# EAGLE schematic wled-switch-rev1 (EAGLE 7.3.0)
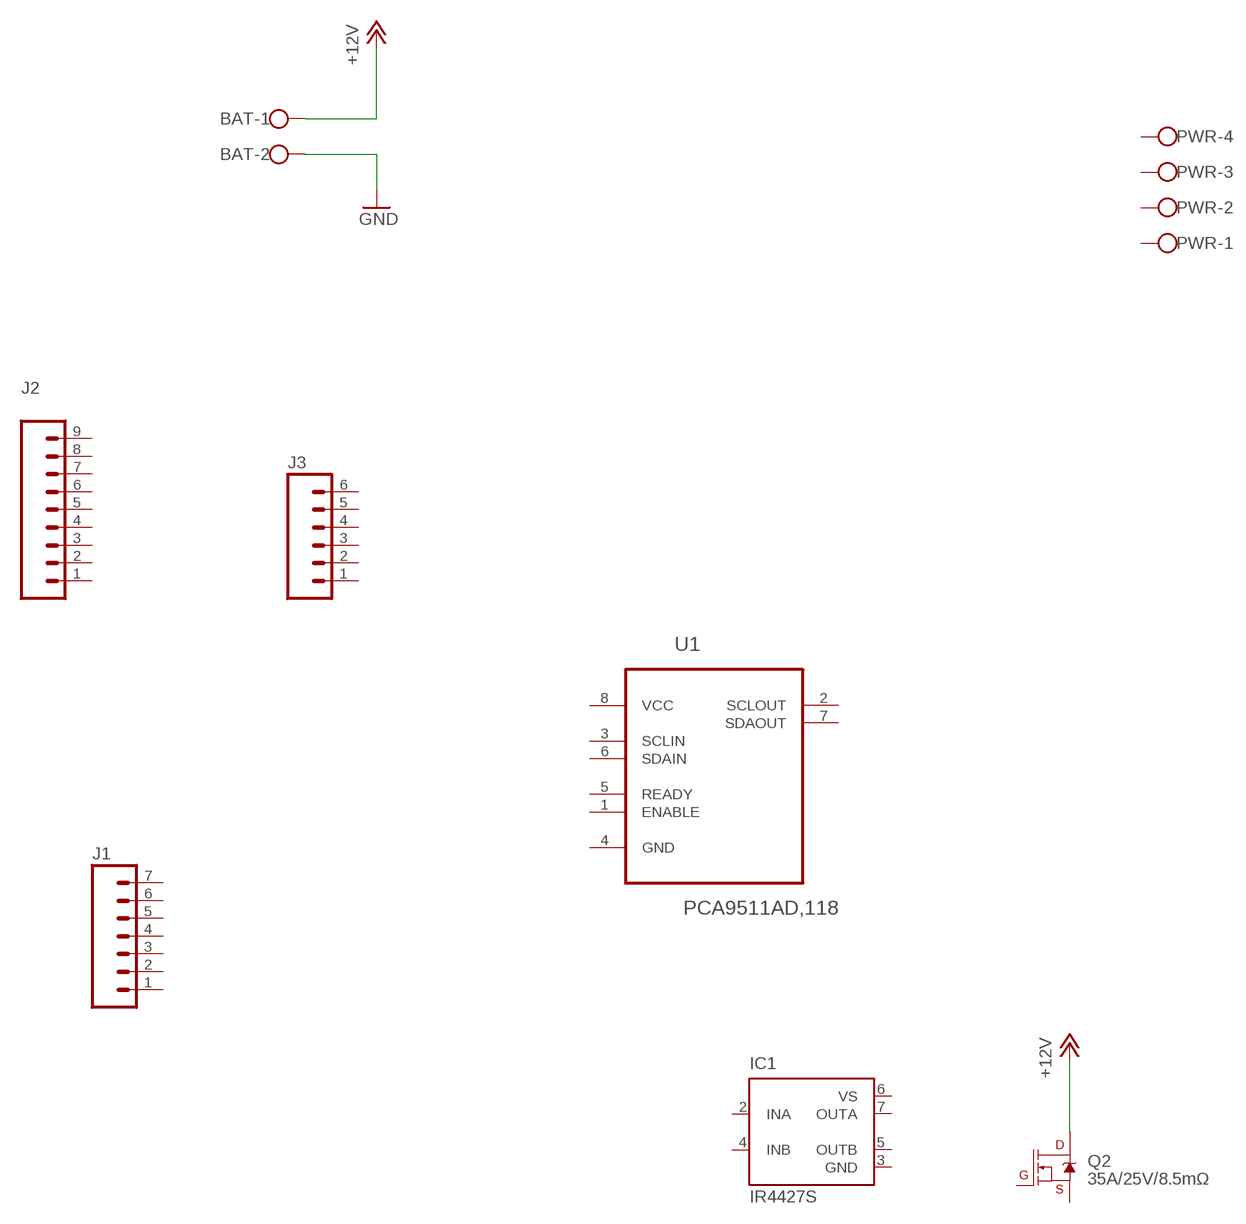
[diagram p0: schematic, sheet 1]

## Parts
BAT  W237-102  [W237-102]
IC1  IR4427S  [SO08]
J1  M07  [1X07]
J2  M09  [1X09]
J3  M06SILK_FEMALE_PTH  [1X06]
PWR  W237-4  [W237-4]
Q2  35A/25V/8.5mΩ  MOSFET-NCH-FDD8780  [TO-252/DPAK]
U1  PCA9511AD,118  [SOIC127P600X175-8N]

## Nets
+12V: BAT.1 Q2.2(D)
GND: BAT.2
Unconnected: IC1.2(INA) IC1.4(INB) IC1.5(OUTB) IC1.7(OUTA) J1.1 J1.2 J1.3 J1.4 J1.5 J1.6 J1.7 J2.1 J2.2 J2.3 J2.4 J2.5 J2.6 J2.7 J2.8 J2.9 J3.1 J3.2 J3.3 J3.4 J3.5 J3.6 PWR.1 PWR.2 PWR.3 PWR.4 Q2.1(G) Q2.3(S) U1.1(ENABLE) U1.2(SCLOUT) U1.3(SCLIN) U1.4(GND) U1.5(READY) U1.6(SDAIN) U1.7(SDAOUT)

## Power pins joined to a net without a drawn wire
GND: IC1.3(GND)
VCC: U1.8(VCC)
VS: IC1.6(VS)

## Library data of the parts
BAT = con-wago-500:W237-102: WAGO SCREW CLAMP; MPN: 237-102; OC_FARNELL: unknown; OC_NEWARK: 70K9898
IC1 = ir:IR4427: DUAL LOW SIDE DRIVER Source: ID4426.pdf; MF: INTERNATIONAL RECTIFIER(IR); MPN: IR4427STRPBF; OC_FARNELL: 8639094; OC_NEWARK: 63J7933
J1 = SparkFun-Connectors:M07: Header 7 Standard 7-pin 0.1" header. Use with straight break away headers (SKU : PRT-00116), right angle break away headers (PRT-00553), swiss pins (PRT-00743), machine pins (PRT-00117), and female headers (PRT-00115). NOTES ON THE VARIANTS LOCK and LOCK_LONGPADS... This footprint was designed to help hold the alignment of a through-hole component (i.e. 7-pin header) while soldering it into place. You may notice that each hole has been shifted either up or down by 0.005 of an inch from it's more standard position (which is usually a perfectly straight line). This slight alteration caused the pins (the squares in the middle) to touch the edges of the holes. Because they are alternating, it causes a "brace" to hold the header in place. 0.005 has proven to be the perfect amount of "off-center" position when using our standard breakaway headers. Although looks a little odd when you look at the bare footprint, once you have a header in there, the alteration is very hard to notice. Also, if you push a header all the way into place, it is covered up entirely on the bottom side. This idea of altering the position of holes to aid alignment will be further integrated into the Sparkfun Library for other footprints. It can help hold any component with 3 or more connection pins.
J2 = SparkFun-Connectors:M09: Header 9 Standard 9-pin 0.1" header. Use with straight break away headers (SKU : PRT-00116), right angle break away headers (PRT-00553), swiss pins (PRT-00743), machine pins (PRT-00117), and female headers (PRT-00115).
J3 = SparkFun-Connectors:M06: Header 6 Standard 6-pin 0.1" header. Use with straight break away headers (SKU : PRT-00116), right angle break away headers (PRT-00553), swiss pins (PRT-00743), machine pins (PRT-00117), and female headers (PRT-00115). Molex polarized connector foot print use with SKU : PRT-08094 with associated crimp pins and housings. NOTES ON THE VARIANTS LOCK and LOCK_LONGPADS... This footprint was designed to help hold the alignment of a through-hole component (i.e. 6-pin header) while soldering it into place. You may notice that each hole has been shifted either up or down by 0.005 of an inch from it's more standard position (which is a perfectly straight line). This slight alteration caused the pins (the squares in the middle) to touch the edges of the holes. Because they are alternating, it causes a "brace" to hold the component in place. 0.005 has proven to be the perfect amount of "off-center" position when using our standard breakaway headers. Although looks a little odd when you look at the bare footprint, once you have a header in there, the alteration is very hard to notice. Also,if you push a header all the way into place, it is covered up entirely on the bottom side. This idea of altering the position of holes to aid alignment will be further integrated into the Sparkfun Library for other footprints. It can help hold any component with 3 or more connection pins.; PROD_ID: CONN-08437
PWR = con-wago-500:W237-4: WAGO SCREW CLAMP; OC_FARNELL: unknown; OC_NEWARK: unknown
Q2 = SparkFun-DiscreteSemi:MOSFET-NCH: N-channel MOSFETs Voltage controlled devices that allow control of high current outputs. SparkFun Products: SparkFun OpenScale <https://www.sparkfun.com/products/13261> SparkFun Digital Sandbox <https://www.sparkfun.com/products/12651> SparkFun Monster Moto Shield <https://www.sparkfun.com/products/10182> SparkFun MOSFET Power Controller <https://www.sparkfun.com/products/11214>; PROD_ID: TRANS-09984
U1 = NXP_By_element14_Batch_1:PCA9511AD,118: Hot swappable I2C-bus and SMBus bus buffer; MPN: PCA9511AD,118; OC_FARNELL: -; OC_NEWARK: 70R6468; PACKAGE: SOIC-8; SUPPLIER: NXP